# Altium schematic sheet UI.SchDoc
size A2
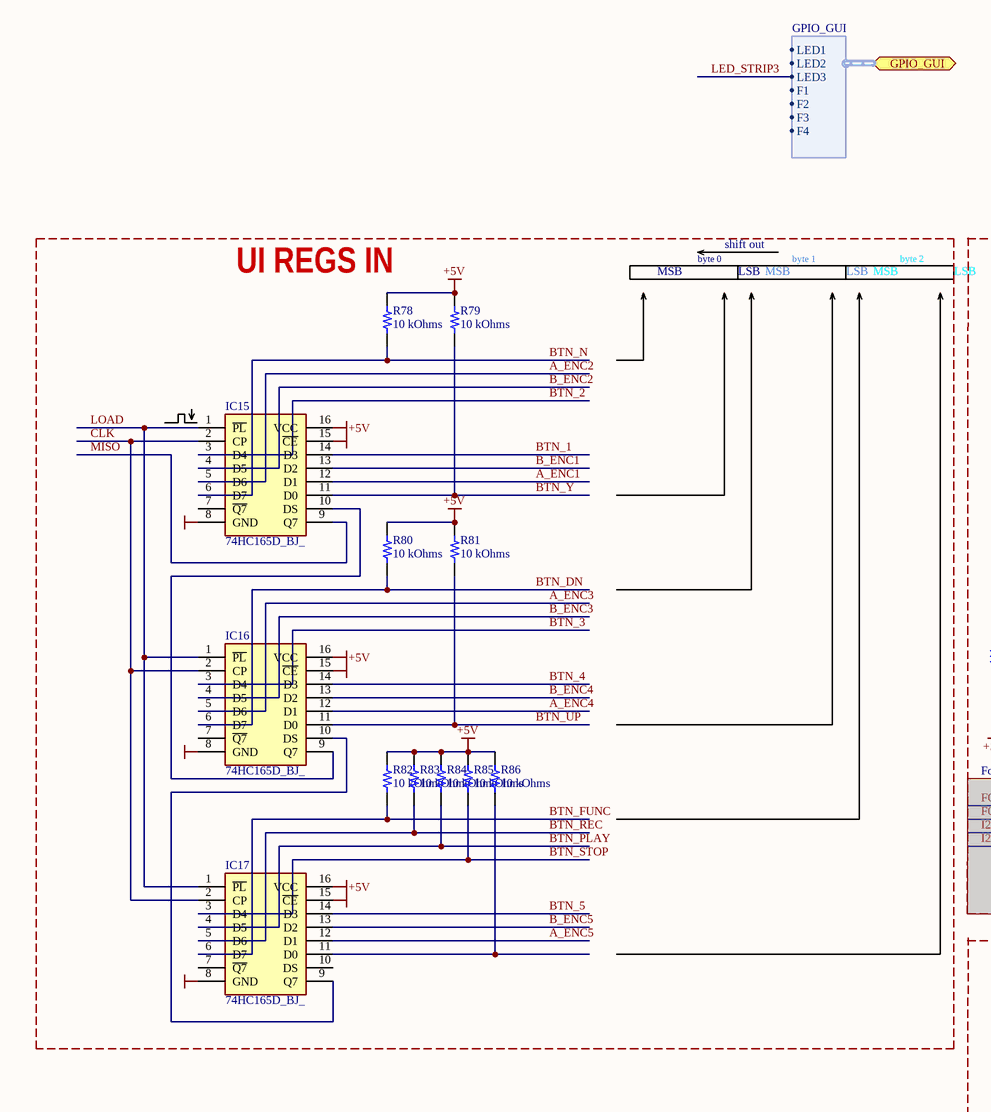
[diagram p0: UI.SchDoc, left]
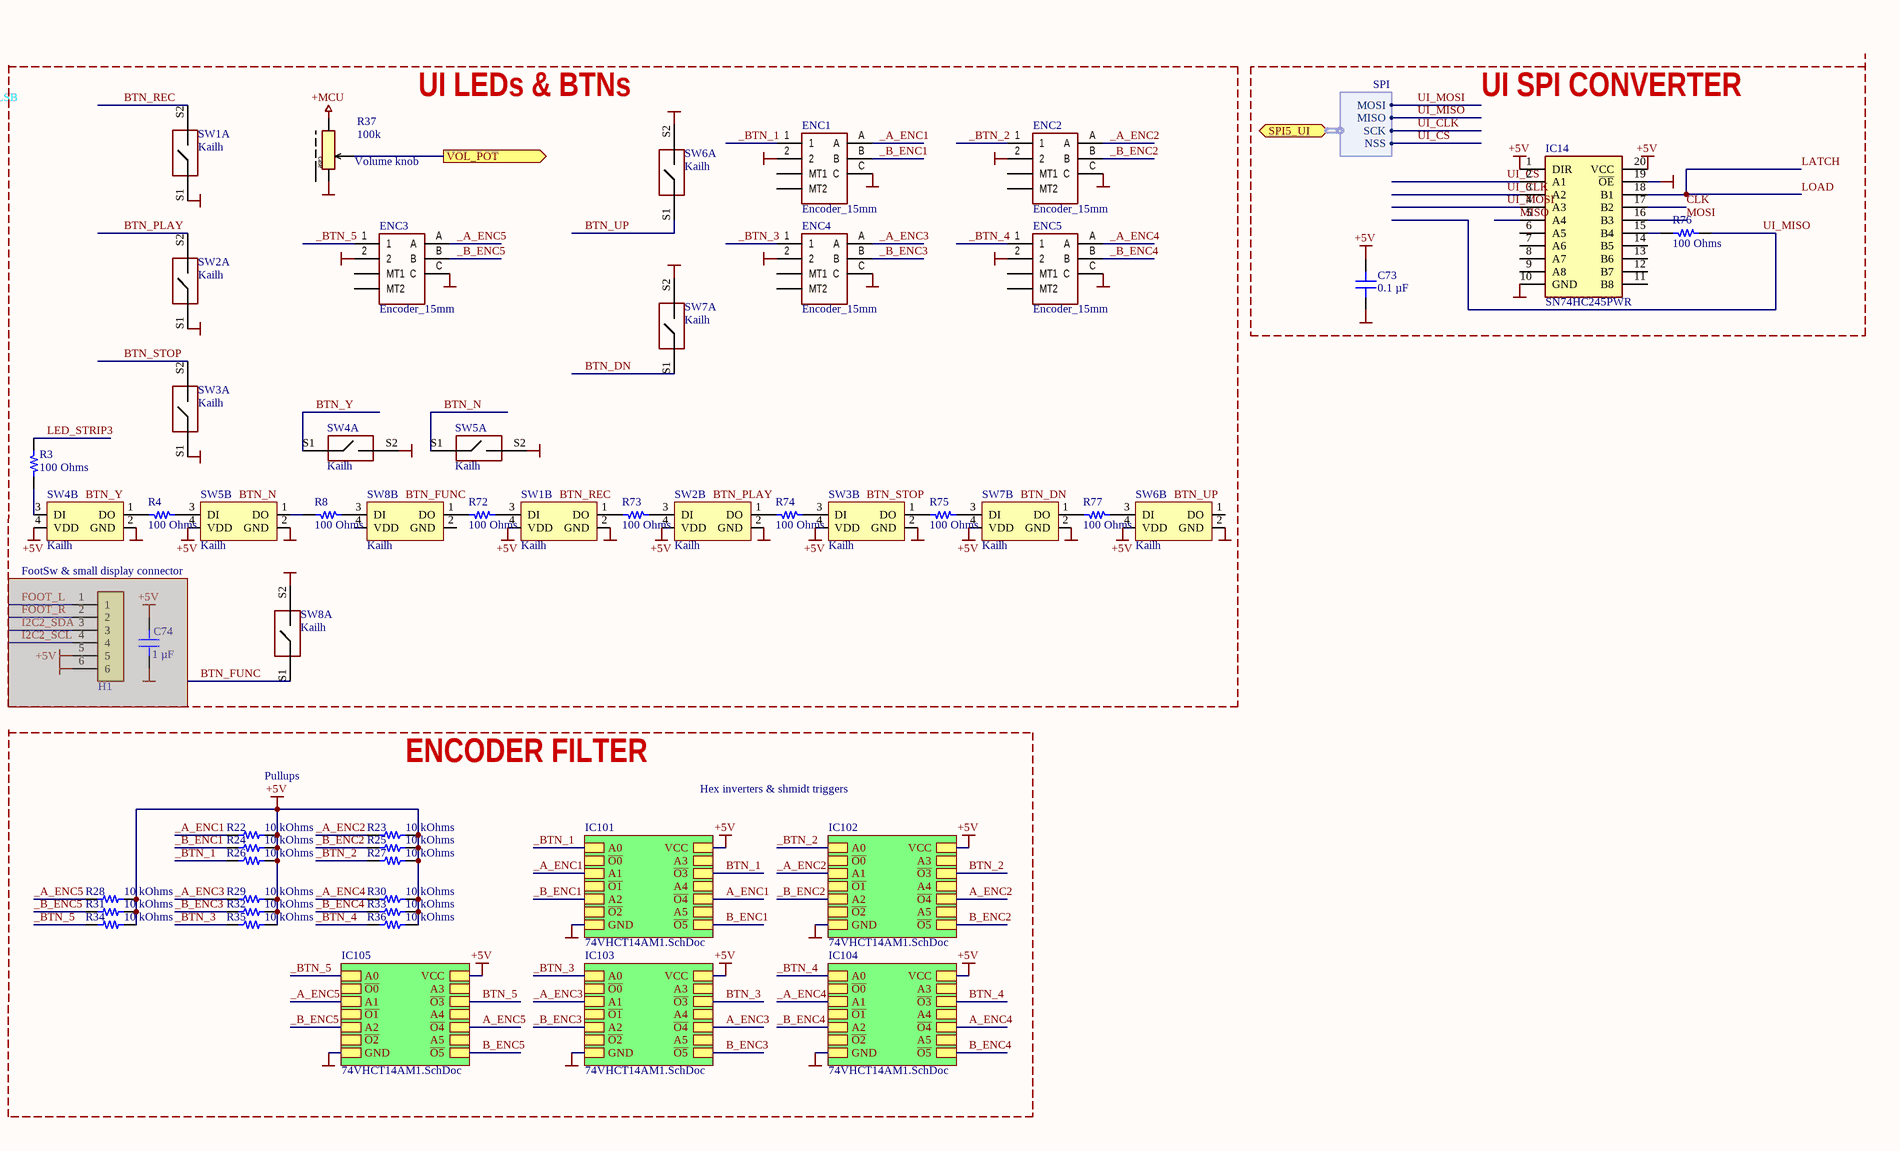
[diagram p1: UI.SchDoc, right]

## Parts
C73  0.1 µF  [CAP 0603_1608]
C74  1 µF  [CAP 0805_2012]  (masked out: inside a compile mask, not in the netlist)
ENC1  Encoder_15mm  [EC11_15mm]
ENC2  Encoder_15mm  [EC11_15mm]
ENC3  Encoder_15mm  [EC11_15mm]
ENC4  Encoder_15mm  [EC11_15mm]
ENC5  Encoder_15mm  [EC11_15mm]
H1  1.5-6A  [1.5-6A]  (value not drawn)  (masked out: inside a compile mask, not in the netlist)
IC14  SN74HC245PWR  [SOP65P640X120-20N]
IC15  74HC165D_BJ_  [SOIC127P600X175-16N]
IC16  74HC165D_BJ_  [SOIC127P600X175-16N]
IC17  74HC165D_BJ_  [SOIC127P600X175-16N]
R3  100 Ohms  [RES 0402_1005]
R4  100 Ohms  [RES 0402_1005]
R8  100 Ohms  [RES 0402_1005]
R22  10 kOhms  [RES 0603_1608]
R23  10 kOhms  [RES 0603_1608]
R24  10 kOhms  [RES 0603_1608]
R25  10 kOhms  [RES 0603_1608]
R26  10 kOhms  [RES 0603_1608]
R27  10 kOhms  [RES 0603_1608]
R28  10 kOhms  [RES 0603_1608]
R29  10 kOhms  [RES 0603_1608]
R30  10 kOhms  [RES 0603_1608]
R31  10 kOhms  [RES 0603_1608]
R32  10 kOhms  [RES 0603_1608]
R33  10 kOhms  [RES 0603_1608]
R34  10 kOhms  [RES 0603_1608]
R35  10 kOhms  [RES 0603_1608]
R36  10 kOhms  [RES 0603_1608]
R37  100k  [POT]
R72  100 Ohms  [RES 0402_1005]
R73  100 Ohms  [RES 0402_1005]
R74  100 Ohms  [RES 0402_1005]
R75  100 Ohms  [RES 0402_1005]
R76  100 Ohms  [RES 0402_1005]
R77  100 Ohms  [RES 0402_1005]
R78  10 kOhms  [RES 0603_1608]
R79  10 kOhms  [RES 0603_1608]
R80  10 kOhms  [RES 0603_1608]
R81  10 kOhms  [RES 0603_1608]
R82  10 kOhms  [RES 0603_1608]
R83  10 kOhms  [RES 0603_1608]
R84  10 kOhms  [RES 0603_1608]
R85  10 kOhms  [RES 0603_1608]
R86  10 kOhms  [RES 0603_1608]
SW1  Kailh  [KAILH_UNI_MX_WS2812]  (parts A,B of 2)
SW2  Kailh  [KAILH_UNI_MX_WS2812]  (parts A,B of 2)
SW3  Kailh  [KAILH_UNI_MX_WS2812]  (parts A,B of 2)
SW4  Kailh  [KAILH_UNI_MX_WS2812]  (parts A,B of 2)
SW5  Kailh  [KAILH_UNI_MX_WS2812]  (parts A,B of 2)
SW6  Kailh  [KAILH_UNI_MX_WS2812]  (parts A,B of 2)
SW7  Kailh  [KAILH_UNI_MX_WS2812]  (parts A,B of 2)
SW8  Kailh  [KAILH_UNI_MX_WS2812]  (parts A,B of 2)

## Blocks framed on the sheet
UI REGS IN: IC15-IC17 R78-R86
UI LEDs & BTNs: C74 ENC1-ENC5 H1 R3 R4 R8 R37 R72-R75 R77 SW1-SW8
ENCODER FILTER: R22-R36

## Sub-sheets
IC101 = 74VHCT14AM1.SchDoc: A0, ~{O0}, A1, ~{O1}, A2, ~{O2}, GND, VCC, A3, ~{O3}, A4, ~{O4}, A5, ~{O5}
IC102 = 74VHCT14AM1.SchDoc: A0, ~{O0}, A1, ~{O1}, A2, ~{O2}, GND, VCC, A3, ~{O3}, A4, ~{O4}, A5, ~{O5}
IC103 = 74VHCT14AM1.SchDoc: A0, ~{O0} (harness GPIO_GUI), A1, ~{O1}, A2, ~{O2}, GND, VCC, A3 (harness GPIO_GUI), ~{O3}, A4, ~{O4}, A5, ~{O5}
IC104 = 74VHCT14AM1.SchDoc: A0, ~{O0} (harness GPIO_GUI), A1, ~{O1}, A2, ~{O2}, GND, VCC, A3 (harness GPIO_GUI), ~{O3}, A4, ~{O4}, A5, ~{O5}
IC105 = 74VHCT14AM1.SchDoc: A0, ~{O0}, A1, ~{O1}, A2, ~{O2}, GND, VCC, A3 (harness GPIO_GUI), ~{O3}, A4 (harness GPIO_GUI), ~{O4}, A5 (harness GPIO_GUI), ~{O5}

## Ports
GPIO_GUI (bidir, harness GPIO_GUI), SPI5_UI (bidir, harness SPI), VOL_POT (out)

## Harnesses
SPI: MOSI, MISO, SCK, NSS
GPIO_GUI: LED1, LED2, F1, F2, F3, F4, LED3

## Nets
+5V: C73.2 IC14.1(DIR) IC14.20(VCC) IC15.16(VCC) IC16.16(VCC) IC17.16(VCC) R22.2 R23.2 R24.2 R25.2 R26.2 R27.2 R28.2 R29.2 R30.2 R31.2 R32.2 R33.2 R34.2 R35.2 R36.2 R78.2 R79.2 R80.2 R81.2 R82.2 R83.2 R84.2 R85.2 R86.2 SW1.4(VDD) SW2.4(VDD) SW3.4(VDD) SW4.4(VDD) SW5.4(VDD) SW6.4(VDD) SW7.4(VDD) ; sheet IC101/VCC, sheet IC102/VCC, sheet IC103/VCC, sheet IC104/VCC, sheet IC105/VCC
+MCU: R37.1
GND: C73.1 ENC1.2 ENC1.C ENC2.2 ENC2.C ENC3.2 ENC3.C ENC4.2 ENC4.C ENC5.2 ENC5.C IC14.10(GND) IC14.19(~{OE}) IC15.8(GND) IC15.15(~{CE}) IC16.8(GND) IC16.15(~{CE}) IC17.8(GND) IC17.15(~{CE}) R37.3 SW1.2(GND) SW1.S1 SW2.2(GND) SW2.S1 SW3.2(GND) SW3.S1 SW4.2(GND) SW4.S2 SW5.2(GND) SW5.S2 SW6.2(GND) SW6.S2 SW7.2(GND) SW7.S2 SW8.S2 ; sheet IC101/GND, sheet IC102/GND, sheet IC103/GND, sheet IC104/GND, sheet IC105/GND
_A_ENC1: ENC1.A R22.1 ; sheet IC101/A1
_A_ENC2: ENC2.A R23.1 ; sheet IC102/A1
_A_ENC3: ENC4.A R29.1 ; sheet IC103/A1
_A_ENC4: ENC5.A R30.1 ; sheet IC104/A1
_A_ENC5: ENC3.A R28.1 ; sheet IC105/A1
_B_ENC1: ENC1.B R24.1 ; sheet IC101/A2
_B_ENC2: ENC2.B R25.1 ; sheet IC102/A2
_B_ENC3: ENC4.B R32.1 ; sheet IC103/A2
_B_ENC4: ENC5.B R33.1 ; sheet IC104/A2
_B_ENC5: ENC3.B R31.1 ; sheet IC105/A2
_BTN_1: ENC1.1 R26.1 ; sheet IC101/A0
_BTN_2: ENC2.1 R27.1 ; sheet IC102/A0
_BTN_3: ENC4.1 R35.1 ; sheet IC103/A0
_BTN_4: ENC5.1 R36.1 ; sheet IC104/A0
_BTN_5: ENC3.1 R34.1 ; sheet IC105/A0
A_ENC1: IC15.12(D1) ; sheet IC101/~{O4}
A_ENC2: IC15.5(D6) ; sheet IC102/~{O4}
A_ENC3: IC16.5(D6) ; sheet IC103/~{O4}
A_ENC4: IC16.12(D1) ; sheet IC104/~{O4}
A_ENC5: IC17.12(D1) ; sheet IC105/~{O4}
B_ENC1: IC15.13(D2) ; sheet IC101/~{O5}
B_ENC2: IC15.4(D5) ; sheet IC102/~{O5}
B_ENC3: IC16.4(D5) ; sheet IC103/~{O5}
B_ENC4: IC16.13(D2) ; sheet IC104/~{O5}
B_ENC5: IC17.13(D2) ; sheet IC105/~{O5}
BTN_1: IC15.14(D3) ; sheet IC101/~{O3}
BTN_2: IC15.3(D4) ; sheet IC102/~{O3}
BTN_3: IC16.3(D4) ; sheet IC103/~{O3}
BTN_4: IC16.14(D3) ; sheet IC104/~{O3}
BTN_5: IC17.14(D3) ; sheet IC105/~{O3}
BTN_DN: IC16.6(D7) R80.1 SW7.S1
BTN_FUNC: IC17.6(D7) R82.1 SW8.S1
BTN_N: IC15.6(D7) R78.1 SW5.S1
BTN_PLAY: IC17.4(D5) R84.1 SW2.S2
BTN_REC: IC17.5(D6) R83.1 SW1.S2
BTN_STOP: IC17.3(D4) R85.1 SW3.S2
BTN_UP: IC16.11(D0) R81.1 SW6.S1
BTN_Y: IC15.11(D0) R79.1 SW4.S1
CLK: IC14.17(B2) IC15.2(CP) IC16.2(CP) IC17.2(CP)
LATCH: IC14.18(B1) IC15.1(~{PL}) IC16.1(~{PL}) IC17.1(~{PL})  [also labelled LOAD]
LED_STRIP3: R3.2 ; port GPIO_GUI.LED3
MISO: IC14.5(A4) IC15.9(Q7)
MOSI: IC14.16(B3)
UI_CLK: IC14.3(A2) ; port SPI5_UI.SCK
UI_CS: IC14.2(A1) ; port SPI5_UI.NSS
UI_MISO: R76.1 ; port SPI5_UI.MISO
UI_MOSI: IC14.4(A3) ; port SPI5_UI.MOSI
VOL_POT: R37.2 ; port VOL_POT
NetIC14_15: IC14.15(B4) R76.2
NetIC15_10: IC15.10(DS) IC16.9(Q7)
NetIC16_10: IC16.10(DS) IC17.9(Q7)
NetIC17_11: IC17.11(D0) R86.1
NetR3_1: R3.1 SW4.3(DI)
NetR4_1: R4.1 SW5.3(DI)
NetR4_2: R4.2 SW4.1(DO)
NetR8_1: R8.1 SW8.3(DI)
NetR8_2: R8.2 SW5.1(DO)
NetR72_1: R72.1 SW1.3(DI)
NetR72_2: R72.2 SW8.1(DO)
NetR73_1: R73.1 SW2.3(DI)
NetR73_2: R73.2 SW1.1(DO)
NetR74_1: R74.1 SW3.3(DI)
NetR74_2: R74.2 SW2.1(DO)
NetR75_1: R75.1 SW7.3(DI)
NetR75_2: R75.2 SW3.1(DO)
NetR77_1: R77.1 SW6.3(DI)
NetR77_2: R77.2 SW7.1(DO)

Not connected (* = marked no-connect by the designer): ENC1 MT1 MT2; ENC2 MT1 MT2; ENC3 MT1 MT2; ENC4 MT1 MT2; ENC5 MT1 MT2; IC14 6(A5) 7(A6) 8(A7) 9(A8) 11(B8) 12(B7) 13(B6) 14(B5); IC15 7(~{Q7}); IC16 7(~{Q7}); IC17 7(~{Q7}) 10(DS); R37 4; SW6 1(DO); SW8 2(GND) 4(VDD)

## Notes on the sheet
- byte 0
- shift out
- byte 1
- byte 2
- MSB
- LSB
- UI SPI CONVERTER
- (near R37) Volume knob
- FootSw & small display connector
- Pullups
- Hex inverters & shmidt triggers
- Labels drawn without touching a wire or pin: BTN_DN, BTN_FUNC, BTN_N, BTN_PLAY, BTN_REC, BTN_STOP, BTN_UP, BTN_Y
- (in symbol POT 9MM 100K) case

## Library data of the parts
C73 = C0603C104K5RAC7411: CAP CER 0.1UF 50V X7R 0603; manufacturer: KEMET; Tolerance: ±10%; Part Number: C0603C104K5RAC7411; Value: 0.1 µF; Applications: Bypass, Decoupling; Capacitance: 0.1 µF; componentlink1description: Datasheet; componentlink1url: https://api.kemet.com/component-edge/download/datasheet/C0603C104K5RAC7411.pdf; componentlink2description: DigiKey Link; componentlink2url: https://www.digikey.com/en/products/detail/kemet/C0603C104K5RAC7411/3317013; Device Package: 0603 (1608 Metric); lastupdated: 2/9/2024 8:10:30 PM; Lifecycle Status: Active; Minimum Order: 1; Mounting Type: Surface Mount, MLCC; Operating Temperature: -55°C ~ 125°C; Package / Case: 0603 (1608 Metric); packaging: TapeAndReel; partid: 2233; Part Status: Active; price: 0.01; series: SMD Comm X7R; Size / Dimension: 0.063" L x 0.031" W (1.60mm x 0.80mm); Supplier 1: DigiKey; Supplier Part Number 1: 399-C0603C104K5RAC7411CT-ND; Temperature Coefficient: X7R; Thickness (Max): 0.035" (0.90mm); Voltage - Rated: 50V
C74 = C0805C105K4RAC7800: CAP CER 1UF 16V X7R 0805; manufacturer: KEMET; Tolerance: ±10%; Part Number: C0805C105K4RAC7800; Value: 1 µF; Applications: Bypass, Decoupling; Capacitance: 1 µF; componentlink1description: Datasheet; componentlink1url: https://api.kemet.com/component-edge/download/datasheet/C0805C105K4RACTU.pdf; componentlink2description: DigiKey Link; componentlink2url: https://www.digikey.com/en/products/detail/kemet/C0805C105K4RAC7800/416047; Device Package: 0805 (2012 Metric); lastupdated: 9/19/2022 1:03:30 PM; Lifecycle Status: Active; Minimum Order: 1; Mounting Type: Surface Mount, MLCC; Operating Temperature: -55°C ~ 125°C; Package / Case: 0805 (2012 Metric); packaging: TapeAndReel; partid: 32075; Part Status: Active; price: 0.01; series: SMD Comm X7R; Size / Dimension: 0.079" L x 0.049" W (2.00mm x 1.25mm); Supplier 1: DigiKey; Supplier Part Number 1: 399-C0805C105K4RAC7800CT-ND; Temperature Coefficient: X7R; Thickness (Max): 0.039" (1.00mm); Voltage - Rated: 16V
H1 = 1.5-6A: Pin Header p=1.5mm, 6 pins
IC14 = SN74HC245PWR: Integrated Circuit; Manufacturer_Name: Texas Instruments; Datasheet Link: http://www.ti.com/lit/gpn/sn74hc245; Height: 1.2mm; Manufacturer_Part_Number: SN74HC245PWR; Mouser Part Number: 595-SN74HC245PWR; Mouser Price/Stock: https://www.mouser.co.uk/ProductDetail/Texas-Instruments/SN74HC245PWR?qs=JS6RUWRH9DXHcWNikQOotA%3D%3D; Arrow Part Number: SN74HC245PWR; Arrow Price/Stock: https://www.arrow.com/en/products/sn74hc245pwr/texas-instruments?region=nac
IC15-IC17 = 74HC165D_BJ_: Integrated Circuit; Manufacturer_Name: Toshiba; Manufacturer_Part_Number: 74HC165D(BJ); Datasheet Link: https://www.arrow.com/en/products/74hc165d-bj/toshiba?region=nac; Height: 1.75mm; Mouser Part Number: 757-74HC165DBJ; Mouser Price/Stock: https://www.mouser.co.uk/ProductDetail/Toshiba/74HC165DBJ?qs=lQAVKuKFhkJom8fGze1o7Q%3D%3D; Arrow Part Number: 74HC165D(BJ); Arrow Price/Stock: https://www.arrow.com/en/products/74hc165d-bj/toshiba?region=nac
R3 R4 R8 R72-R77 = CRCW0402100RFKEE: RES SMD 100 OHM 1% 1/16W 0402; Manufacturer: Vishay Dale; Power (Watts): 0.063W, 1/16W; Temperature Coefficient: ±100ppm/°C; Part Number: CRCW0402100RFKEE; Value: 100 Ohms; ComponentLink1Description: Datasheet; ComponentLink1URL: http://www.vishay.com/docs/20035/dcrcwe3.pdf; ComponentLink2Description: DigiKey Link; ComponentLink2URL: https://www.digikey.com/en/products/detail/vishay-dale/CRCW0402100RFKEE/5069886; Composition: Thick Film; Device Package: 0402 (1005 Metric); Height - Seated (Max): 0.016" (0.40mm); LastUpdated: 2/9/2024 8:30:05 PM; Lifecycle Status: Active; Minimum Order: 1; Number of Terminations: 2; Operating Temperature: -55°C ~ 155°C; Package / Case: 0402 (1005 Metric); Packaging: CutTape; PartId: 6830; Part Status: Active; Price: 0.01; Resistance: 100 Ohms; Series: CRCW; Size / Dimension: 0.039" L x 0.020" W (1.00mm x 0.50mm); Supplier 1: DigiKey; Supplier Part Number 1: 541-2953-1-ND; Supplier Device Package: 0402; Tolerance: ±1%; Features: Automotive AEC-Q200; Ratings: AEC-Q200
R22-R36 = ERJ-3EKF1002V: RES SMD 10K OHM 1% 1/10W 0603; Part Number: ERJ-3EKF1002V; Value: 10 kOhms
R37 = POT 9MM 100K
R78-R86 = ERJ-3EKF1002V: RES SMD 10K OHM 1% 1/10W 0603; Manufacturer: Panasonic Electronic Components; Power (Watts): 0.1W, 1/10W; Temperature Coefficient: ±100ppm/°C; Part Number: ERJ-3EKF1002V; Value: 10 kOhms; ComponentLink1Description: Datasheet; ComponentLink1URL: https://industrial.panasonic.com/cdbs/www-data/pdf/RDA0000/AOA0000C304.pdf; ComponentLink2Description: DigiKey Link; ComponentLink2URL: https://www.digikey.com/en/products/detail/panasonic-electronic-components/ERJ-3EKF1002V/196066; Composition: Thick Film; Device Package: 0603 (1608 Metric); Height - Seated (Max): 0.022" (0.55mm); LastUpdated: 2/9/2024 8:41:59 PM; Lifecycle Status: Active; Minimum Order: 1; Number of Terminations: 2; Operating Temperature: -55°C ~ 155°C; Package / Case: 0603 (1608 Metric); Packaging: TapeAndReel; PartId: 25695; Part Status: Active; Price: 0.01; Resistance: 10 kOhms; Series: ERJ-3EK; Size / Dimension: 0.063" L x 0.031" W (1.60mm x 0.80mm); Supplier 1: DigiKey; Supplier Part Number 1: P10.0KHCT-ND; Supplier Device Package: 0603; Tolerance: ±1%; Features: Automotive AEC-Q200; Ratings: AEC-Q200
SW1-SW8 = Kailh_hotswap_WS2812: Kailh keyboard switch, hotswap rgb, dual-side hotswap options + low prifile variant